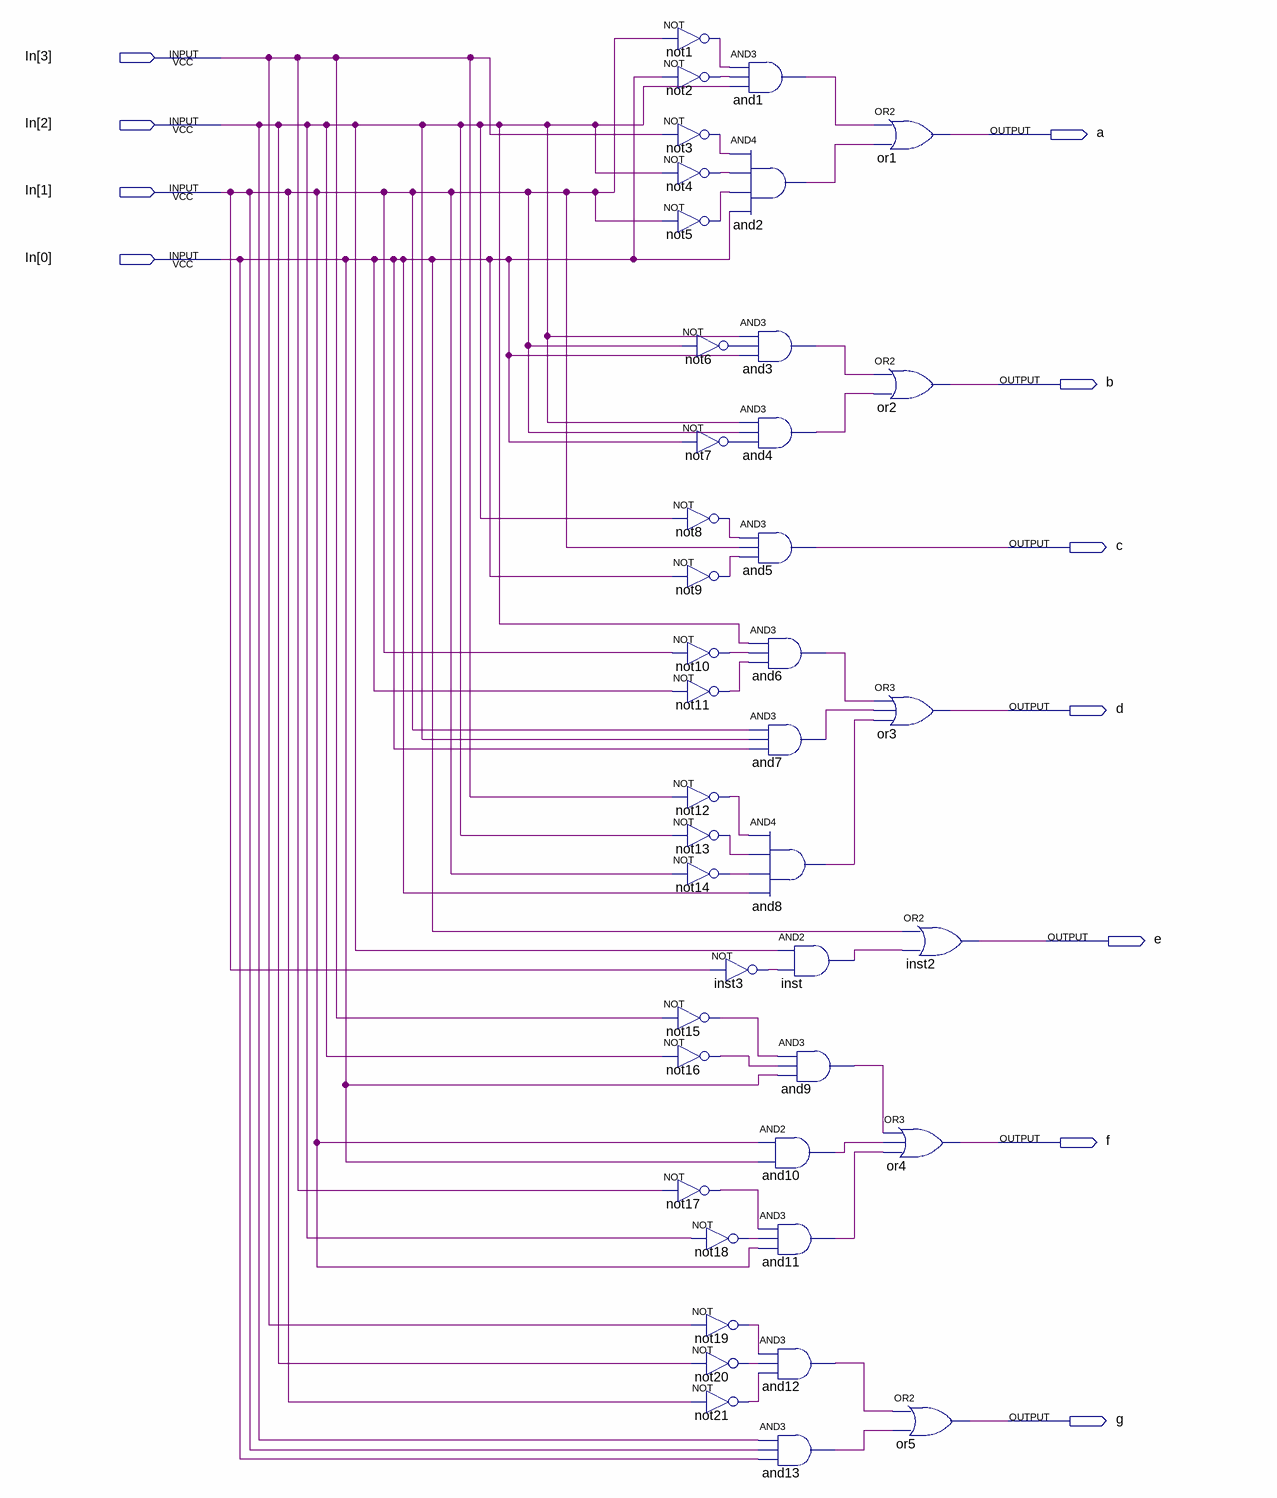
[diagram p0: schematic sheet]
// Quartus schematic display7.bdf as structural Verilog: 42 symbols, 11 pins
module display7 (
  input  [3:0] In,
  output a,
  output b,
  output c,
  output d,
  output e,
  output f,
  output g
);

  wire and1_out, and2_out, and3_out, and4_out, and6_out, and7_out, and8_out, and9_out, and10_out, and11_out,
       and12_out, and13_out, inst3_out, inst_out, not1_out, not2_out, not3_out, not4_out, not5_out, not6_out,
       not7_out, not8_out, not9_out, not10_out, not11_out, not12_out, not13_out, not14_out, not15_out,
       not16_out, not17_out, not18_out, not19_out, not20_out, not21_out;

  not not1 (not1_out, In[1]);
  not not2 (not2_out, In[0]);
  not not3 (not3_out, In[3]);
  not not4 (not4_out, In[2]);
  not not5 (not5_out, In[1]);
  not not8 (not8_out, In[2]);
  not not9 (not9_out, In[0]);
  not not10 (not10_out, In[1]);
  not not11 (not11_out, In[0]);
  not not12 (not12_out, In[3]);
  not not13 (not13_out, In[2]);
  not not14 (not14_out, In[1]);
  not not15 (not15_out, In[3]);
  not not16 (not16_out, In[2]);
  not not17 (not17_out, In[3]);
  and and1 (and1_out, not1_out, not2_out, In[2]);
  and and2 (and2_out, not3_out, not4_out, not5_out, In[0]);
  and and3 (and3_out, In[2], not6_out, In[0]);
  not not6 (not6_out, In[1]);
  and and4 (and4_out, In[2], In[1], not7_out);
  not not7 (not7_out, In[0]);
  and and5 (c, not8_out, In[1], not9_out);
  and and6 (and6_out, In[2], not10_out, not11_out);
  and and7 (and7_out, In[1], In[2], In[0]);
  and and8 (and8_out, not12_out, not13_out, not14_out, In[0]);
  not inst3 (inst3_out, In[1]);
  not not18 (not18_out, In[2]);
  not not19 (not19_out, In[3]);
  not not20 (not20_out, In[2]);
  not not21 (not21_out, In[1]);
  and inst (inst_out, In[2], inst3_out);
  and and9 (and9_out, not15_out, not16_out, In[0]);
  and and10 (and10_out, In[1], In[0]);
  and and11 (and11_out, not17_out, not18_out, In[1]);
  and and12 (and12_out, not19_out, not20_out, not21_out);
  and and13 (and13_out, In[2], In[1], In[0]);
  or or1 (a, and1_out, and2_out);
  or or2 (b, and3_out, and4_out);
  or or3 (d, and6_out, and7_out, and8_out);
  or inst2 (e, In[0], inst_out);
  or or4 (f, and9_out, and10_out, and11_out);
  or or5 (g, and12_out, and13_out);
endmodule
